# Altium schematic sheet usb_and_power.SchDoc
size A4; SheetNumber: 2; SheetTotal: 2; Size: A4; Contact: datasystem.pl
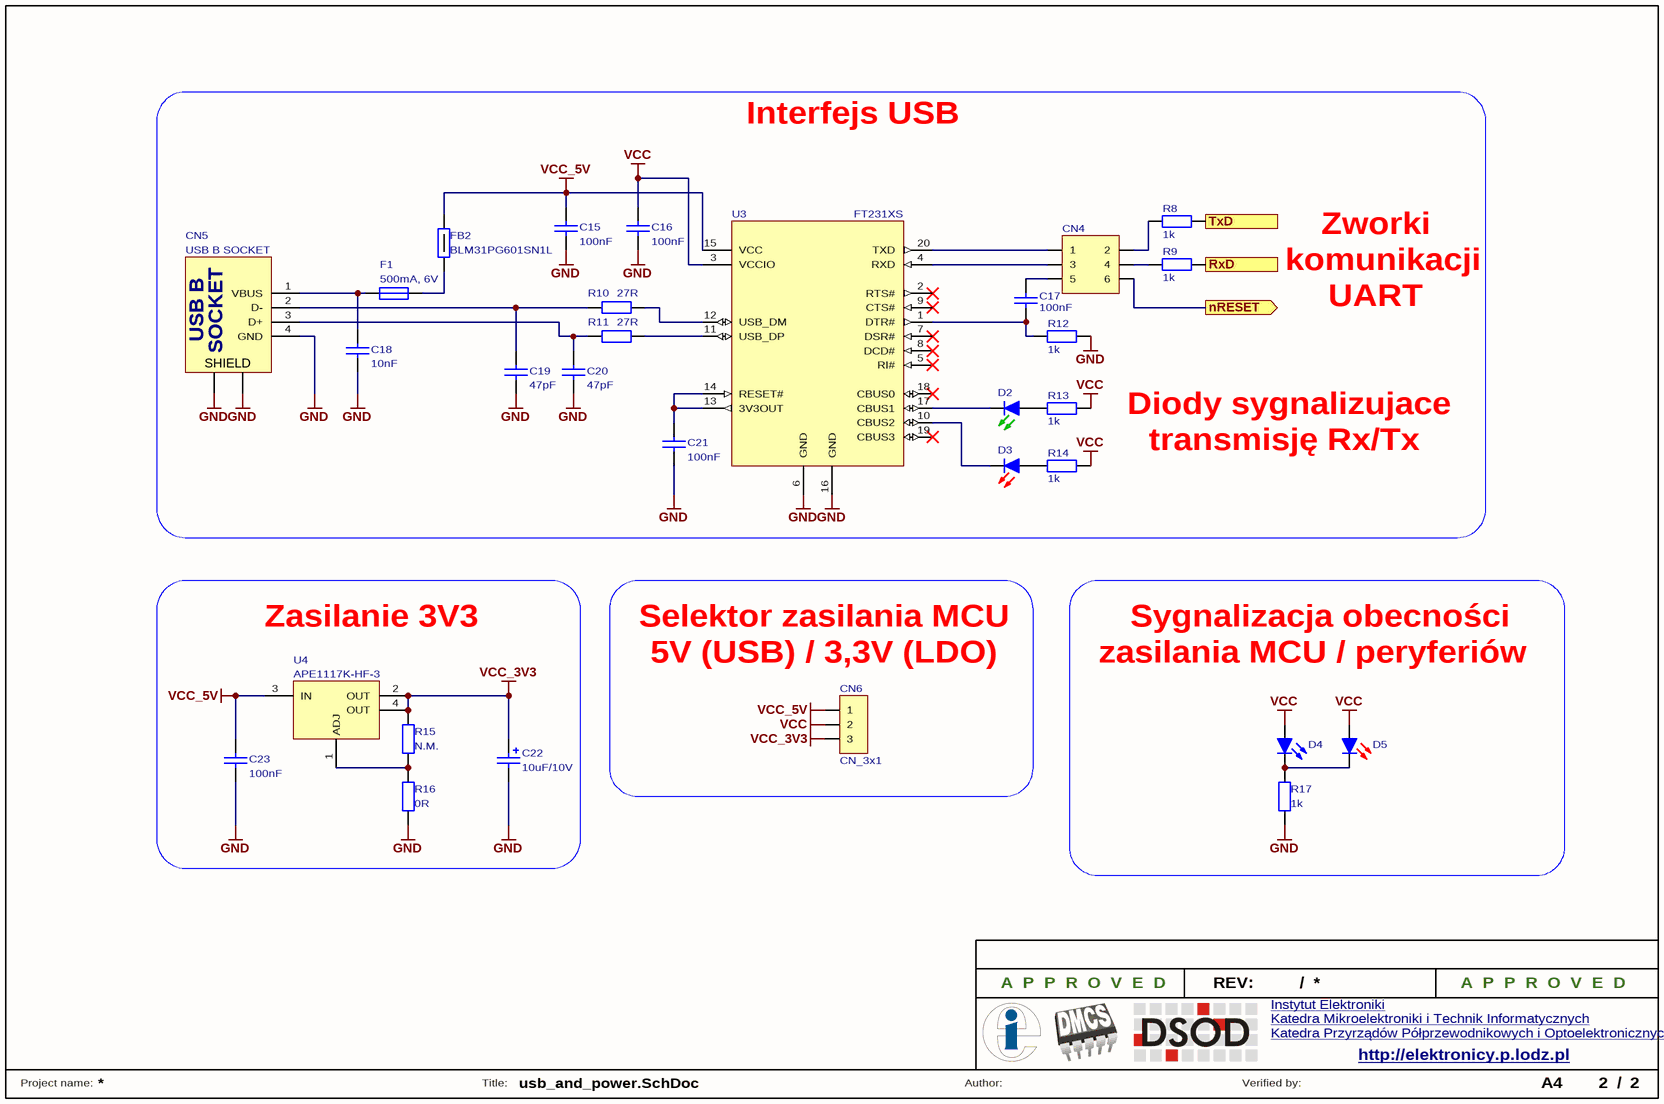
[diagram p0: usb_and_power.SchDoc]

## Parts
C15  100nF  [C1206]
C16  100nF  [C1206]
C17  100nF  [C1206]
C18  10nF  [C1206]
C19  47pF  [C1206]
C20  47pF  [C1206]
C21  100nF  [C1206]
C22  10uF/10V  [SMDB]
C23  100nF  [C1206]
CN4  *  [GP_3x2]  (value not drawn)
CN5  USB B SOCKET  [USBB-G]
CN6  CN_3x1  [GP_3x1H]
D2  *  [LED1206G]  (value not drawn)
D3  *  [LED1206R]  (value not drawn)
D4  LED  [LED-Polarized - 3mm]  (value not drawn)
D5  *  [LED1206R]  (value not drawn)
F1  500mA, 6V  [F1206]
FB2  BLM31PG601SN1L  [FB1206]
R8  1k  [R1206]
R9  1k  [R1206]
R10  27R  [R1206]
R11  27R  [R1206]
R12  1k  [R1206]
R13  1k  [R1206]
R14  1k  [R1206]
R15  N.M.  [R1206]
R16  0R  [R1206]
R17  1k  [R1206]
U3  FT231XS  [SSOP20]
U4  APE1117K-HF-3  [SOT-223]

## Blocks framed on the sheet
Zasilanie 3V3: C22 C23 R15 R16 U4

## Ports
nRESET (out), RxD (in), TxD (out)

## Nets
GND: C15.2 C16.2 C18.2 C19.1 C20.1 C21.1 C22.2 C23.1 CN5.4(GND) CN5.5(SHIELD) CN5.6(SHIELD) R12.1 R16.1 R17.1 U3.6(GND) U3.16(GND)
VCC: C16.1 CN6.2 D4.1(A) D5.1(A) R13.1 R14.1 U3.3(VCCIO)
VCC_3V3: C22.1 CN6.3 R15.2 U4.2(OUT) U4.4(OUT)
VCC_5V: C15.1 C23.2 CN6.1 FB2.1 U3.15(VCC) U4.3(IN)
nRESET: CN4.6 ; port nRESET
RxD: R9.1 ; port RxD
TxD: R8.1 ; port TxD
NetC17_1: C17.1 R12.2 U3.1(DTR#)
NetC17_2: C17.2 CN4.5
NetC18_1: C18.1 CN5.1(VBUS) F1.1
NetC19_2: C19.2 CN5.2(D-) R10.1
NetC20_2: C20.2 CN5.3(D+) R11.1
NetC21_2: C21.2 U3.13(3V3OUT) U3.14(RESET#)
NetCN4_1: CN4.1 U3.20(TXD)
NetCN4_2: CN4.2 R8.2
NetCN4_3: CN4.3 U3.4(RXD)
NetCN4_4: CN4.4 R9.2
NetD2_1: D2.1(A) R13.2
NetD2_2: D2.2(K) U3.17(CBUS1)
NetD3_1: D3.1(A) R14.2
NetD3_2: D3.2(K) U3.10(CBUS2)
NetD4_2: D4.2(K) D5.2(K) R17.2
NetF1_2: F1.2 FB2.2
NetR10_2: R10.2 U3.12(USB_DM)
NetR11_2: R11.2 U3.11(USB_DP)
NetR15_1: R15.1 R16.2 U4.1(ADJ)

Not connected (* = marked no-connect by the designer): U3 2(RTS#)* 5(RI#)* 7(DSR#)* 8(DCD#)* 9(CTS#)* 18(CBUS0)* 19(CBUS3)*

## Notes on the sheet
- Interfejs USB
- Zworki
- komunikacji
- UART
- Diody sygnalizujace
- transmisję Rx/Tx
- Selektor zasilania MCU
- Sygnalizacja obecności
- (near CN6) 5V (USB) / 3,3V (LDO)
- zasilania MCU / peryferiów
- A  P  P  R  O  V  E  D
- REV:
- /
- Instytut Elektroniki <http://www.eletel.p.lodz.pl/>
- Katedra Mikroelektroniki i Technik Informatycznych <https://www.dmcs.pl/>
- Katedra Przyrządów Półprzewodnikowych i Optoelektronicznych <http://www.dsod.p.lodz.pl/>
- http://elektronicy.p.lodz.pl
- Project name:
- Title:
- Author:
- Verified by:
- (in symbol USB B SOCKET) USB B; SOCKET

## Library data of the parts
C15-C21 C23 = Cap: Capacitor; ComponentLink1Description: datasheet; ComponentLink2Description: supplier
  C15-C17 C21 C23: Value: 100nF
  C18: Value: 10nF
  C19 C20: Value: 47pF
C22 = Cap Pol Tant: Polarized Tantalum Capacitor; ComponentLink1Description: datasheet; ComponentLink2Description: supplier; Value: 10uF/10V
CN4 = CN_3x2
CN5 = USB B SOCKET: USB connector; Published: 20-Mar-2006
D2 = LED_GREEN: GREEN LED; Published: 04-Apr-2006
D3 D5 = LED_RED: RED LED; Published: 04-Apr-2006
D4 = LED: Typical RED, GREEN, YELLOW, AMBER GaAs LED; Published: 04-Apr-2006
F1 = 1206L050: 500mA, 6V PTC Fuse; Published: 8-Jun-2000; LatestRevisionDate: 17-Jul-2002; LatestRevisionNote: Re-released for DXP Platform.; PackageReference: PIN-W2/E2.8; Publisher: Altium Limited; PackageDescription: Thru-Hole; 2 Leads; Supplier 1: TME; Supplier Part Number 1: SM010-60
FB2 = BLM31PG601SN1L: Ferrite Bead; Imp.@ 100MHz:600R; Mounting: SMD; 1,5A; Case: 1206
R8-R17 = Res: Resistor; Published: 19-Feb-2006; ComponentLink1Description: datasheet; ComponentLink2Description: supplier
  R8 R9 R12-R14 R17: Value: 1k
  R10 R11: Value: 27R
  R15: Value: N.M.
  R16: Value: 0R
U3 = FT231XS: FT231X USB to UART IC; Published: 07-Mar-2006; PackageReference: SSOP28; ComponentLink1Description: Manufacturer Link; ComponentLink1URL: http://www.ftdichip.com/Products/ICs/FT232R.htm; ComponentLink2Description: Datasheet; ComponentLink2URL: http://www.ftdichip.com/Support/Documents/DataSheets/ICs/DS_FT232R.pdf; Supplier 1: TME; Supplier 2: TME; Supplier 3: Farnell; Supplier 4: Farnell; Supplier Part Number 1: FT231XS-U; Supplier Part Number 2: FT231XS-R; Supplier Part Number 3: 2081328RL; Supplier Part Number 4: 2081328
U4 = APE1117K-HF-3: 800mA Low-Dropout Adjustable, 1A Linear Regulator, SOT223 Package; Published: 24-Aug-2001; LatestRevisionDate: 06-Jun-2005; LatestRevisionNote: PCB Pin sequence re-ordered.; DatasheetVersion: Feb-2004; PackageVersion: Jul-2004; PackageReference: TO-220A; Publisher: Altium Limited; PackageDescription: TO, Thru-Hole, Vertical, Heatsink Mounted; 3 In-Line Leads; Pitch 2.54 mm; ComponentLink1Description: Manufacturer Link; ComponentLink1URL: http://www.st.com/; ComponentLink2Description: Datasheet; ComponentLink2URL: http://www.st.com/stonline/books/pdf/docs/2574.pdf; Supplier 1: TME; Supplier Part Number 1: APE1117K-HF-3